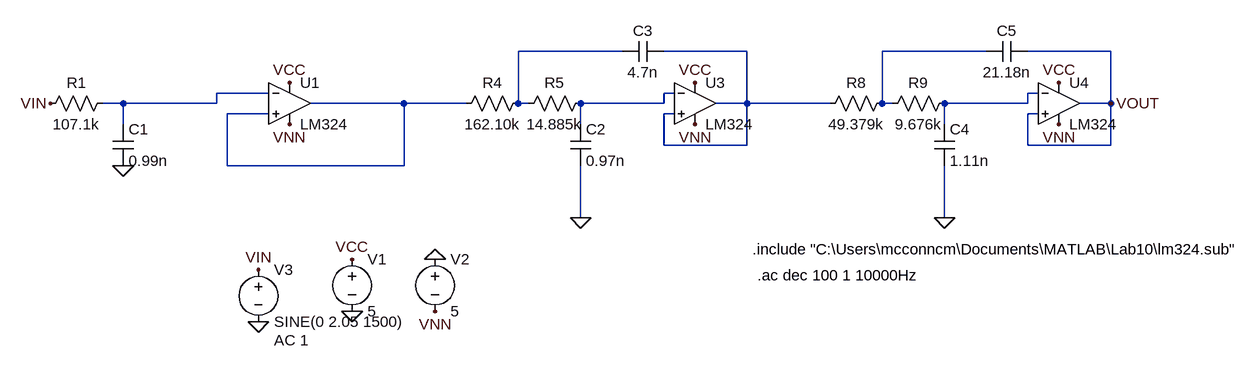
[diagram p0: schematic OverallCircuit.asc]
OverallCircuit.asc, the LTspice schematic file:
Version 4
SHEET 1 1928 680
WIRE 896 -48 736 -48
WIRE 1088 -48 960 -48
WIRE 1456 -48 1296 -48
WIRE 1648 -48 1520 -48
WIRE 352 16 272 16
WIRE 976 16 960 16
WIRE 1536 16 1520 16
WIRE 128 32 96 32
WIRE 272 32 272 16
WIRE 272 32 128 32
WIRE 560 32 416 32
WIRE 656 32 560 32
WIRE 736 32 736 -48
WIRE 752 32 736 32
WIRE 960 32 960 16
WIRE 960 32 832 32
WIRE 1088 32 1088 -48
WIRE 1088 32 1040 32
WIRE 1216 32 1088 32
WIRE 1296 32 1296 -48
WIRE 1312 32 1296 32
WIRE 1520 32 1520 16
WIRE 1520 32 1392 32
WIRE 1648 32 1648 -48
WIRE 1648 32 1600 32
WIRE 352 48 288 48
WIRE 976 48 960 48
WIRE 1536 48 1520 48
WIRE 128 64 128 32
WIRE 832 64 832 32
WIRE 1392 64 1392 32
WIRE 960 96 960 48
WIRE 1088 96 1088 32
WIRE 1088 96 960 96
WIRE 1520 96 1520 48
WIRE 1648 96 1648 32
WIRE 1648 96 1520 96
WIRE 288 128 288 48
WIRE 560 128 560 32
WIRE 560 128 288 128
WIRE 832 208 832 128
WIRE 1392 208 1392 128
FLAG 128 128 0
FLAG 384 0 VCC
FLAG 1008 0 VCC
FLAG 1568 0 VCC
FLAG 384 64 VNN
FLAG 1008 64 VNN
FLAG 1568 64 VNN
FLAG 1648 32 VOUT
FLAG 16 32 VIN
FLAG 480 272 VCC
FLAG 608 352 VNN
FLAG 336 288 VIN
FLAG 480 352 0
FLAG 336 368 0
FLAG 608 272 0
FLAG 832 208 0
FLAG 1392 208 0
SYMBOL res 112 16 R90
WINDOW 0 0 56 VBottom 2
WINDOW 3 32 56 VTop 2
SYMATTR InstName R1
SYMATTR Value 107.1k
SYMBOL cap 112 64 R0
SYMATTR InstName C1
SYMATTR Value 0.99n
SYMBOL LM324 384 32 R0
SYMATTR InstName U1
SYMBOL res 752 16 R90
WINDOW 0 0 56 VBottom 2
WINDOW 3 32 56 VTop 2
SYMATTR InstName R4
SYMATTR Value 162.10k
SYMBOL LM324 1008 32 R0
SYMATTR InstName U3
SYMBOL res 848 16 R90
WINDOW 0 0 56 VBottom 2
WINDOW 3 32 56 VTop 2
SYMATTR InstName R5
SYMATTR Value 14.885k
SYMBOL cap 816 64 R0
SYMATTR InstName C2
SYMATTR Value 0.97n
SYMBOL cap 960 -64 R90
WINDOW 0 0 32 VBottom 2
WINDOW 3 32 32 VTop 2
SYMATTR InstName C3
SYMATTR Value 4.7n
SYMBOL res 1312 16 R90
WINDOW 0 0 56 VBottom 2
WINDOW 3 32 56 VTop 2
SYMATTR InstName R8
SYMATTR Value 49.379k
SYMBOL LM324 1568 32 R0
SYMATTR InstName U4
SYMBOL res 1408 16 R90
WINDOW 0 0 56 VBottom 2
WINDOW 3 32 56 VTop 2
SYMATTR InstName R9
SYMATTR Value 9.676k
SYMBOL cap 1376 64 R0
SYMATTR InstName C4
SYMATTR Value 1.11n
SYMBOL cap 1520 -64 R90
WINDOW 0 0 32 VBottom 2
WINDOW 3 32 32 VTop 2
SYMATTR InstName C5
SYMATTR Value 21.18n
SYMBOL voltage 480 256 R0
WINDOW 123 0 0 Left 0
WINDOW 39 0 0 Left 0
SYMATTR InstName V1
SYMATTR Value 5
SYMBOL voltage 608 256 R0
WINDOW 123 0 0 Left 0
WINDOW 39 0 0 Left 0
SYMATTR InstName V2
SYMATTR Value 5
SYMBOL voltage 336 272 R0
WINDOW 123 24 124 Left 2
WINDOW 39 0 0 Left 0
SYMATTR Value2 AC 1
SYMATTR InstName V3
SYMATTR Value SINE(0 2.05 1500)
TEXT 1104 296 Left 2 !.ac dec 100 1 10000Hz
TEXT 1096 256 Left 2 !.include "C:\\Users\\mcconncm\\Documents\\MATLAB\\Lab10\\lm324.sub"

The netlist it stands for:
* OverallCircuit.asc
R1 N004 VIN 107.1k
C1 N004 0 0.99n
* U1: LM324 (symbol LM324 not available, pins judged from their places): In+=N007 In-=N004 V+=VCC V-=VNN OUT=N007
R4 N001 N007 162.10k
* U3: LM324 (symbol LM324 not available, pins judged from their places): In+=N002 In-=N005 V+=VCC V-=VNN OUT=N002
R5 N005 N001 14.885k
C2 N005 0 0.97n
C3 N002 N001 4.7n
R8 N003 N002 49.379k
* U4: LM324 (symbol LM324 not available, pins judged from their places): In+=VOUT In-=N006 V+=VCC V-=VNN OUT=VOUT
R9 N006 N003 9.676k
C4 N006 0 1.11n
C5 VOUT N003 21.18n
V1 VCC 0 5
V2 0 VNN 5
V3 VIN 0 SINE(0 2.05 1500) AC 1
.ac dec 100 1 10000Hz
.include "C:\Users\mcconncm\Documents\MATLAB\Lab10\lm324.sub"
.backanno
.end